# EAGLE design adapter_v2 (EAGLE 9.4.2)
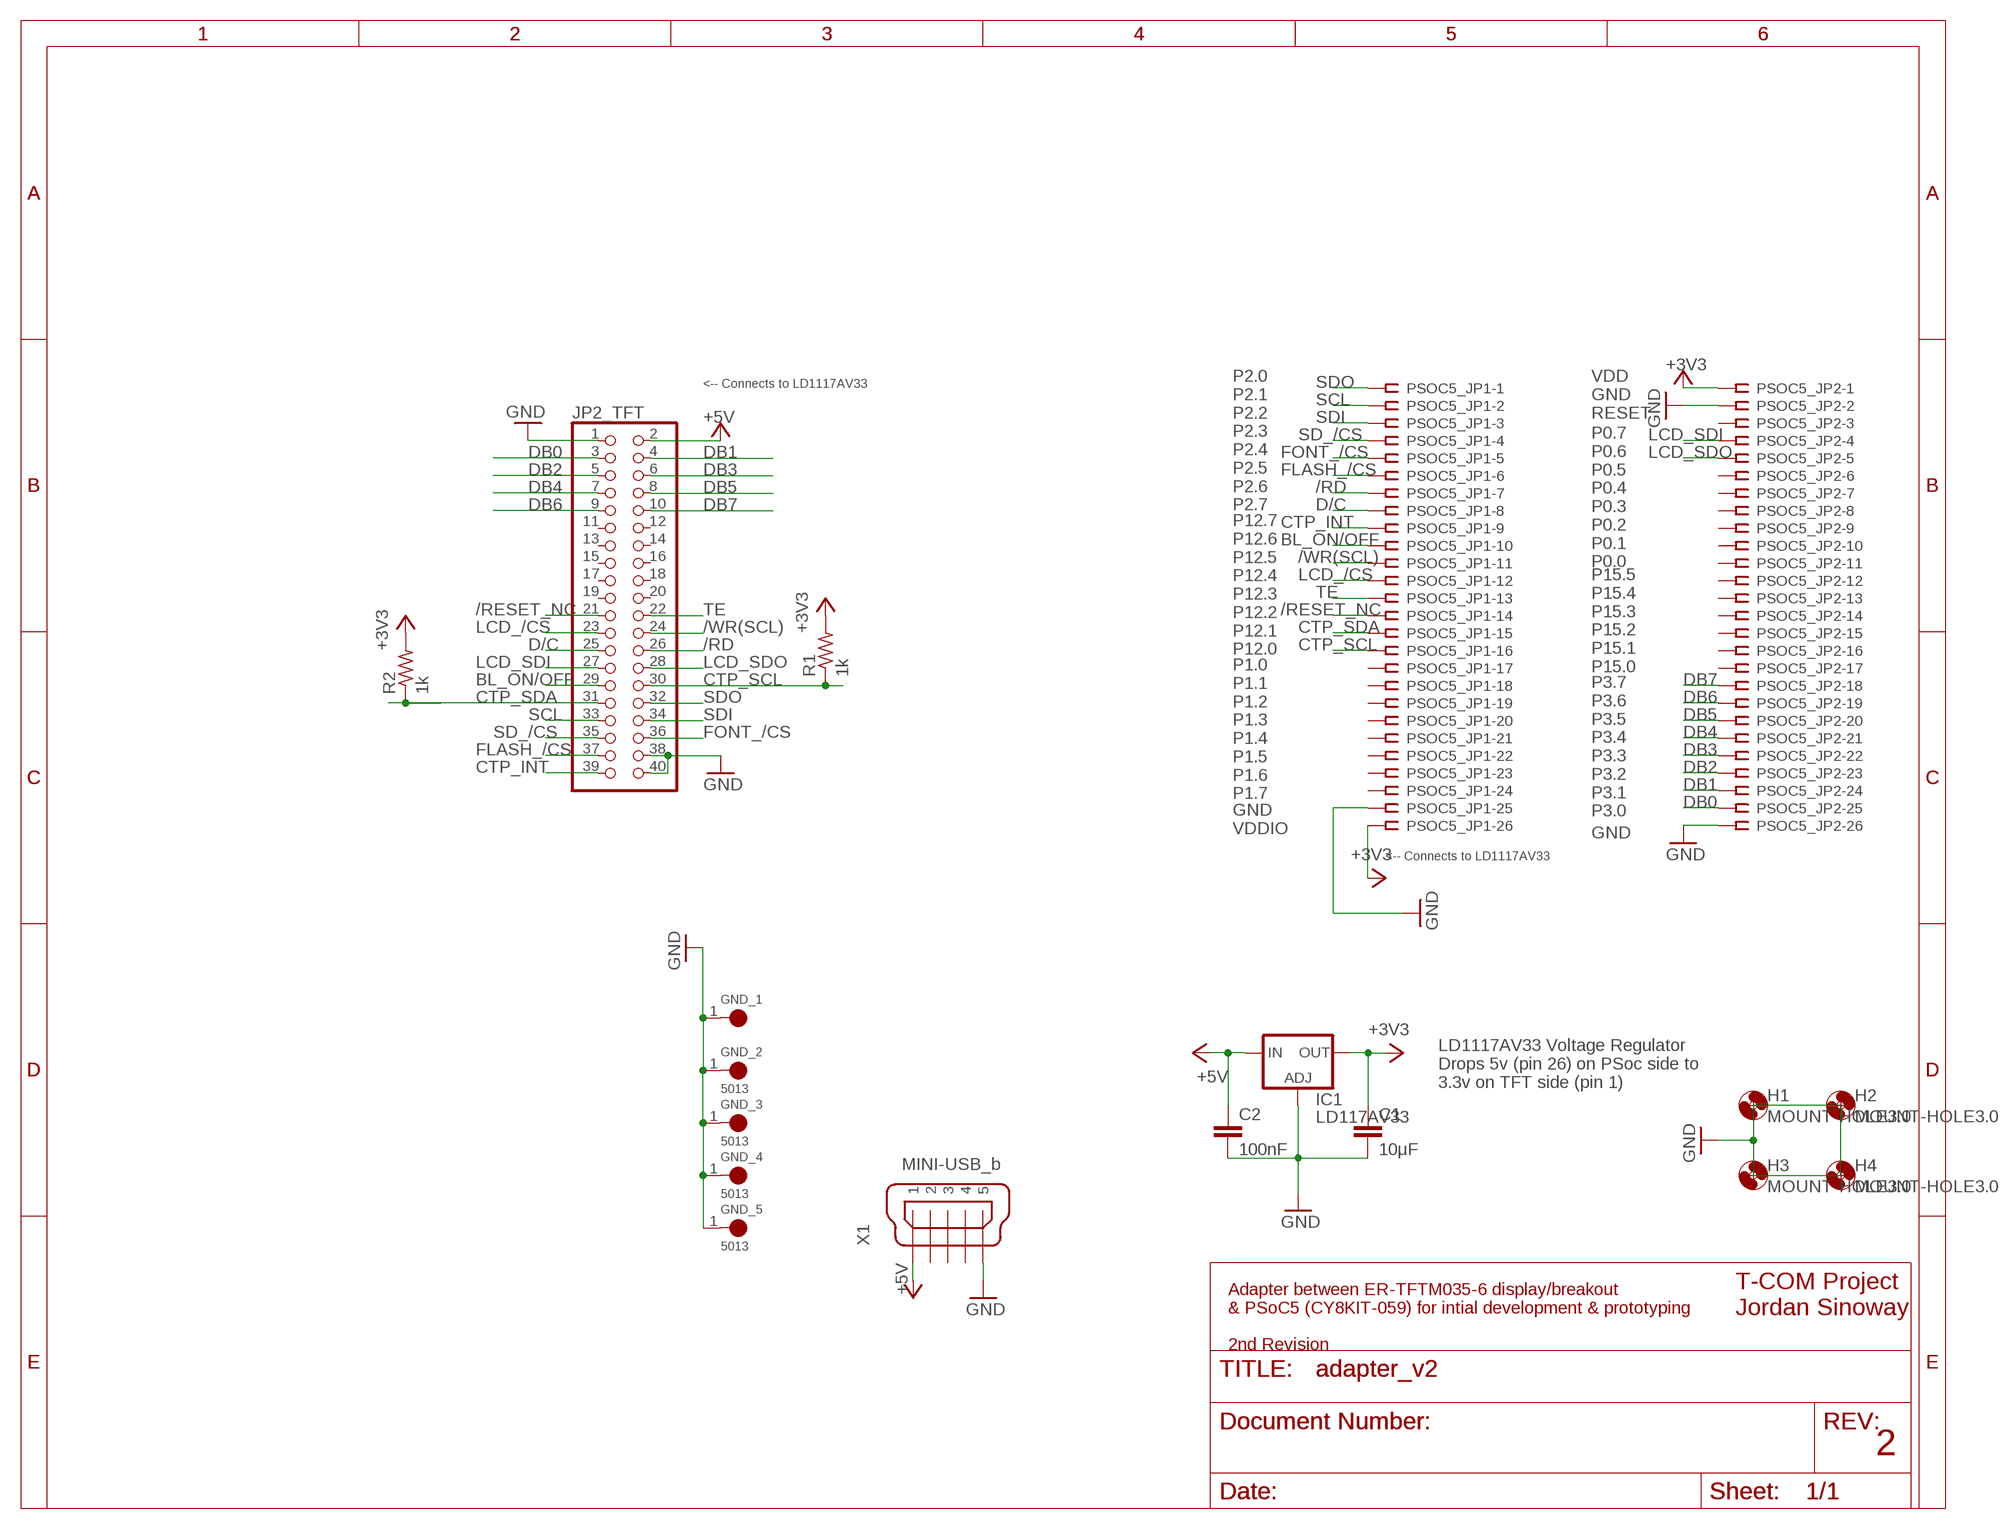
[diagram p0: schematic, sheet 1]

## Parts
C1  10μF  C2.5/2  [C2.5-2]
C2  100nF  C2.5/2  [C2.5-2]
GND_1  5013  [TESTPOINT_5013]
GND_2  5013  [TESTPOINT_5013]
GND_3  5013  [TESTPOINT_5013]
GND_4  5013  [TESTPOINT_5013]
GND_5  5013  [TESTPOINT_5013]
H1  MOUNT-HOLE3.0  [3,0]
H2  MOUNT-HOLE3.0  [3,0]
H3  MOUNT-HOLE3.0  [3,0]
H4  MOUNT-HOLE3.0  [3,0]
IC1  LD117AV33  [TO220L1]
JP2_TFT  PINHD-2X20  [2X20]
PSOC5_JP1  SSW-126-02-G-S  [SSW-126-02-G-S]
PSOC5_JP2  SSW-126-02-G-S  [SSW-126-02-G-S]
R1  1k  R-US_0204/7  [0204/7]
R2  1k  R-US_0204/7  [0204/7]
X1  MINI-USB_b  MINI-USB_SHIELD5P2-32005-601  [32005-601]

## Nets
+3V3 [GND/voltage]: C1.1 IC1.2(OUT) PSOC5_JP1.26 PSOC5_JP2.1 R1.2 R2.2
+5V [GND/voltage]: C2.1 IC1.3(IN) JP2_TFT.2 X1.1
/RD: JP2_TFT.26 PSOC5_JP1.7
/RESET_NC: JP2_TFT.21 PSOC5_JP1.14
/WR(SCL): JP2_TFT.24 PSOC5_JP1.11
BL_ON/OFF: JP2_TFT.29 PSOC5_JP1.10
CTP_INT: JP2_TFT.39 PSOC5_JP1.9
CTP_SCL: JP2_TFT.30 PSOC5_JP1.16 R1.1
CTP_SDA: JP2_TFT.31 PSOC5_JP1.15 R2.1
D/C: JP2_TFT.25 PSOC5_JP1.8
DB0: JP2_TFT.3 PSOC5_JP2.25
DB1: JP2_TFT.4 PSOC5_JP2.24
DB2: JP2_TFT.5 PSOC5_JP2.23
DB3: JP2_TFT.6 PSOC5_JP2.22
DB4: JP2_TFT.7 PSOC5_JP2.21
DB5: JP2_TFT.8 PSOC5_JP2.20
DB6: JP2_TFT.9 PSOC5_JP2.19
DB7: JP2_TFT.10 PSOC5_JP2.18
FLASH_/CS: JP2_TFT.37 PSOC5_JP1.6
FONT_/CS: JP2_TFT.36 PSOC5_JP1.5
GND [GND/voltage]: C1.2 C2.2 GND_1.1(TP) GND_2.1(TP) GND_3.1(TP) GND_4.1(TP) GND_5.1(TP) IC1.1(ADJ) JP2_TFT.1 JP2_TFT.38 JP2_TFT.40 PSOC5_JP1.25 PSOC5_JP2.2 PSOC5_JP2.26 X1.5
LCD_/CS: JP2_TFT.23 PSOC5_JP1.12
LCD_SDI: JP2_TFT.27 PSOC5_JP2.4
LCD_SDO: JP2_TFT.28 PSOC5_JP2.5
SCL: JP2_TFT.33 PSOC5_JP1.2
SD_/CS: JP2_TFT.35 PSOC5_JP1.4
SDI: JP2_TFT.34 PSOC5_JP1.3
SDO: JP2_TFT.32 PSOC5_JP1.1
TE: JP2_TFT.22 PSOC5_JP1.13
Unconnected: JP2_TFT.11 JP2_TFT.12 JP2_TFT.13 JP2_TFT.14 JP2_TFT.15 JP2_TFT.16 JP2_TFT.17 JP2_TFT.18 JP2_TFT.19 JP2_TFT.20 PSOC5_JP1.17 PSOC5_JP1.18 PSOC5_JP1.19 PSOC5_JP1.20 PSOC5_JP1.21 PSOC5_JP1.22 PSOC5_JP1.23 PSOC5_JP1.24 PSOC5_JP2.3 PSOC5_JP2.6 PSOC5_JP2.7 PSOC5_JP2.8 PSOC5_JP2.9 PSOC5_JP2.10 PSOC5_JP2.11 PSOC5_JP2.12 PSOC5_JP2.13 PSOC5_JP2.14 PSOC5_JP2.15 PSOC5_JP2.16 PSOC5_JP2.17 X1.2 X1.3 X1.4 X1.M1(S1) X1.M2(S2)

## Notes on the sheet
- <-- Connects to LD1117AV33
- VDD
  GND
  RESET
- P2.0
  P2.1
  P2.2
  P2.3
  P2.4
  P2.5
  P2.6
  P2.7
- P0.7
  P0.6
  P0.5
  P0.4
  P0.3
  P0.2
  P0.1
  P0.0
- P12.7
  P12.6
  P12.5
  P12.4
  P12.3
  P12.2
  P12.1
  P12.0
- P15.5
  P15.4
  P15.3
  P15.2
  P15.1
  P15.0
- P1.0
  P1.1
  P1.2
  P1.3
  P1.4
  P1.5
  P1.6
  P1.7
- P3.7
  P3.6
  P3.5
  P3.4
  P3.3
  P3.2
  P3.1
  P3.0
- GND
  VDDIO
- GND
- <-- Connects to LD1117AV33
- LD1117AV33 Voltage Regulator
  Drops 5v (pin 26) on PSoc side to
  3.3v on TFT side (pin 1)
- T-COM Project
  Jordan Sinoway
- Adapter between ER-TFTM035-6 display/breakout 
  & PSoC5 (CY8KIT-059) for intial development & prototyping
  
  2nd Revision
- 2

## Library data of the parts
C1 C2 = capacitor-wima:C: CAPACITOR naming: grid - package width
GND_1-GND_5 = 5013:5013: Test Point; Orange; Thru-Hole; Snap-Fit; SilverPlate; 0.063in. Dia.; 0.445In.; AVAILABILITY: Unavailable; DESCRIPTION: Test Point; Orange; Thru-Hole; Snap-Fit; SilverPlate; 0.063in. Dia.; 0.445In.; MF: Keystone Electronics; MP: 5013; PACKAGE: TO-5 Keystone; PRICE: None
H1-H4 = holes:MOUNT-HOLE: MOUNTING HOLE with drill center marker
IC1 = v-reg:LD117A?*: Low drop fixed and adjustable positive voltage regulators 1 A Source: http://www.st.com/stonline/products/literature/ds/7194/ld1117axx.pdf
JP2_TFT = pinhead:PINHD-2X20: PIN HEADER
PSOC5_JP1 PSOC5_JP2 = con-samtec:SSW-126-02-G-S: THROUGH-HOLE .025" SQ POST SOCKET Source: Samtec SSW.pdf; MF: Samtec Inc.; MPN: SSW-126-02-G-S; OC_FARNELL: unknown; OC_NEWARK: 11P9742
R1 R2 = resistor:R-US_: RESISTOR, American symbol
X1 = con-cypressindustries:MINI-USB_SHIELD5P2-: MINI USB-B R/A DIP 5pol. Source: www.cypressindustries.com; OC_FARNELL: unknown; OC_NEWARK: unknown

## Net classes
0 default: clearance 0.102 mm
1 GND/voltage: width 0.457 mm, drill 0.152 mm, clearance 0.152 mm

## Board
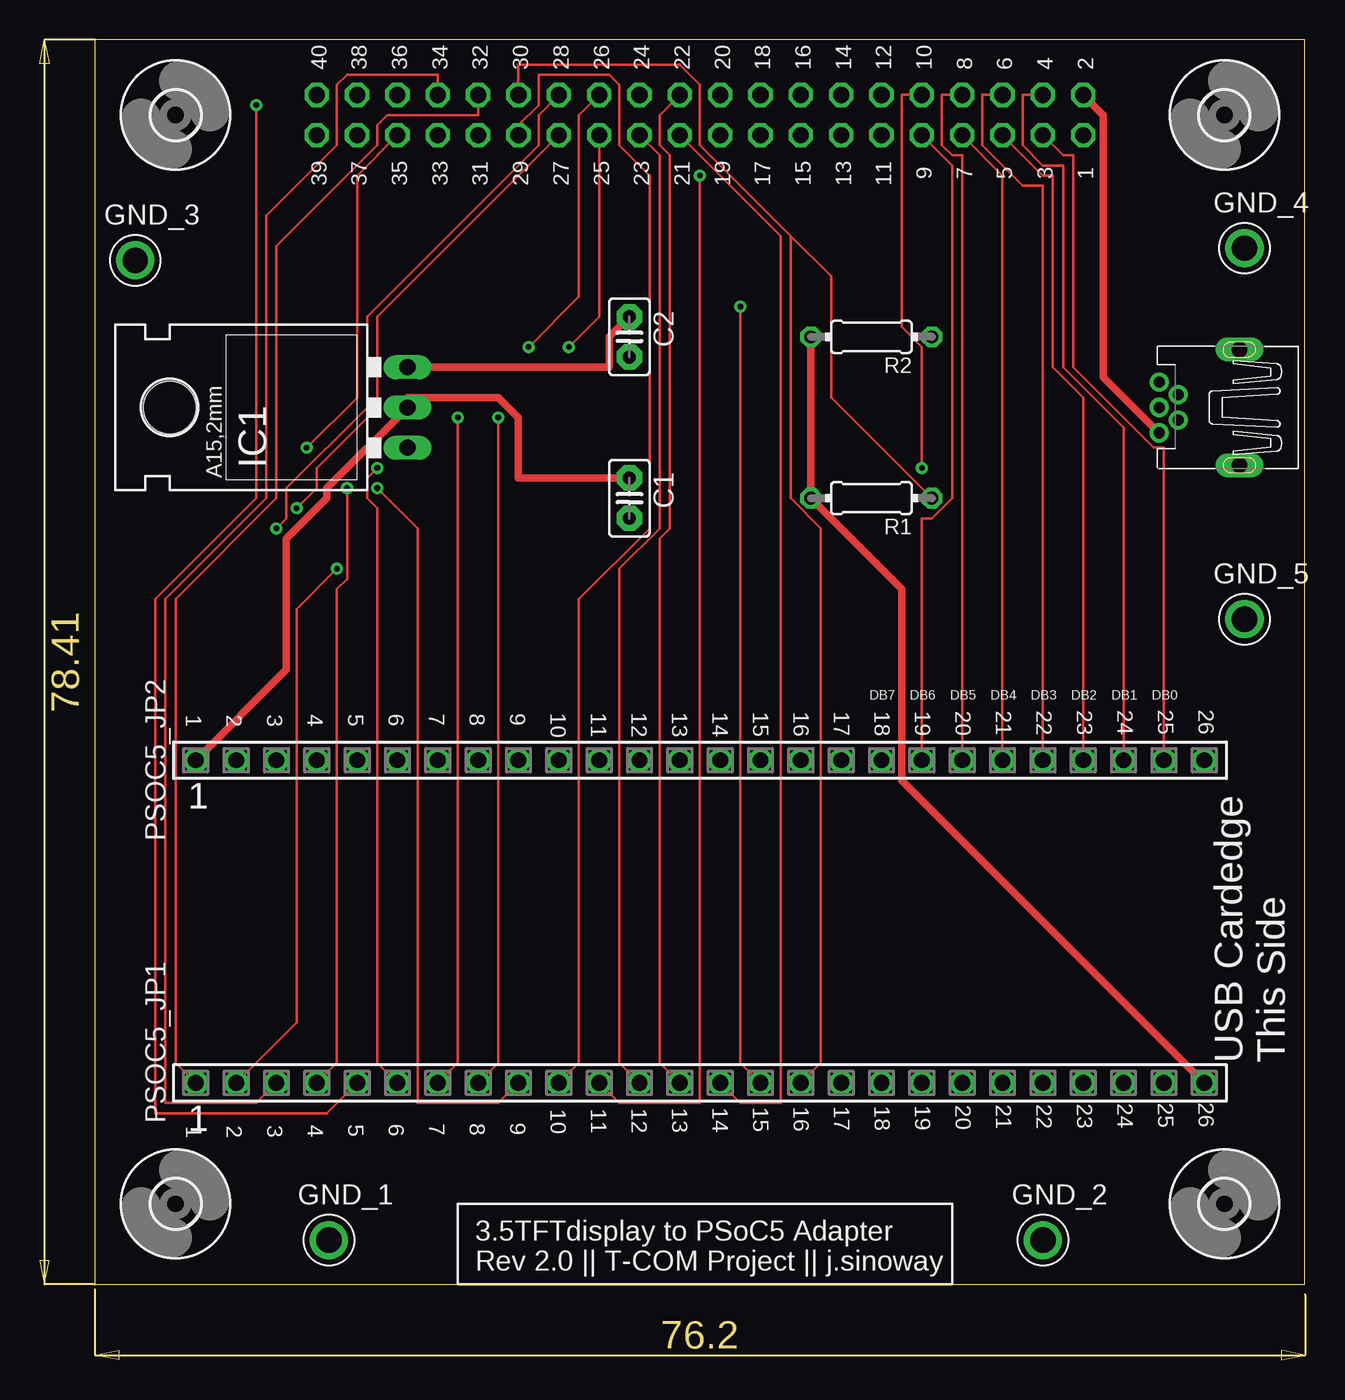
[diagram p1: board, top side]
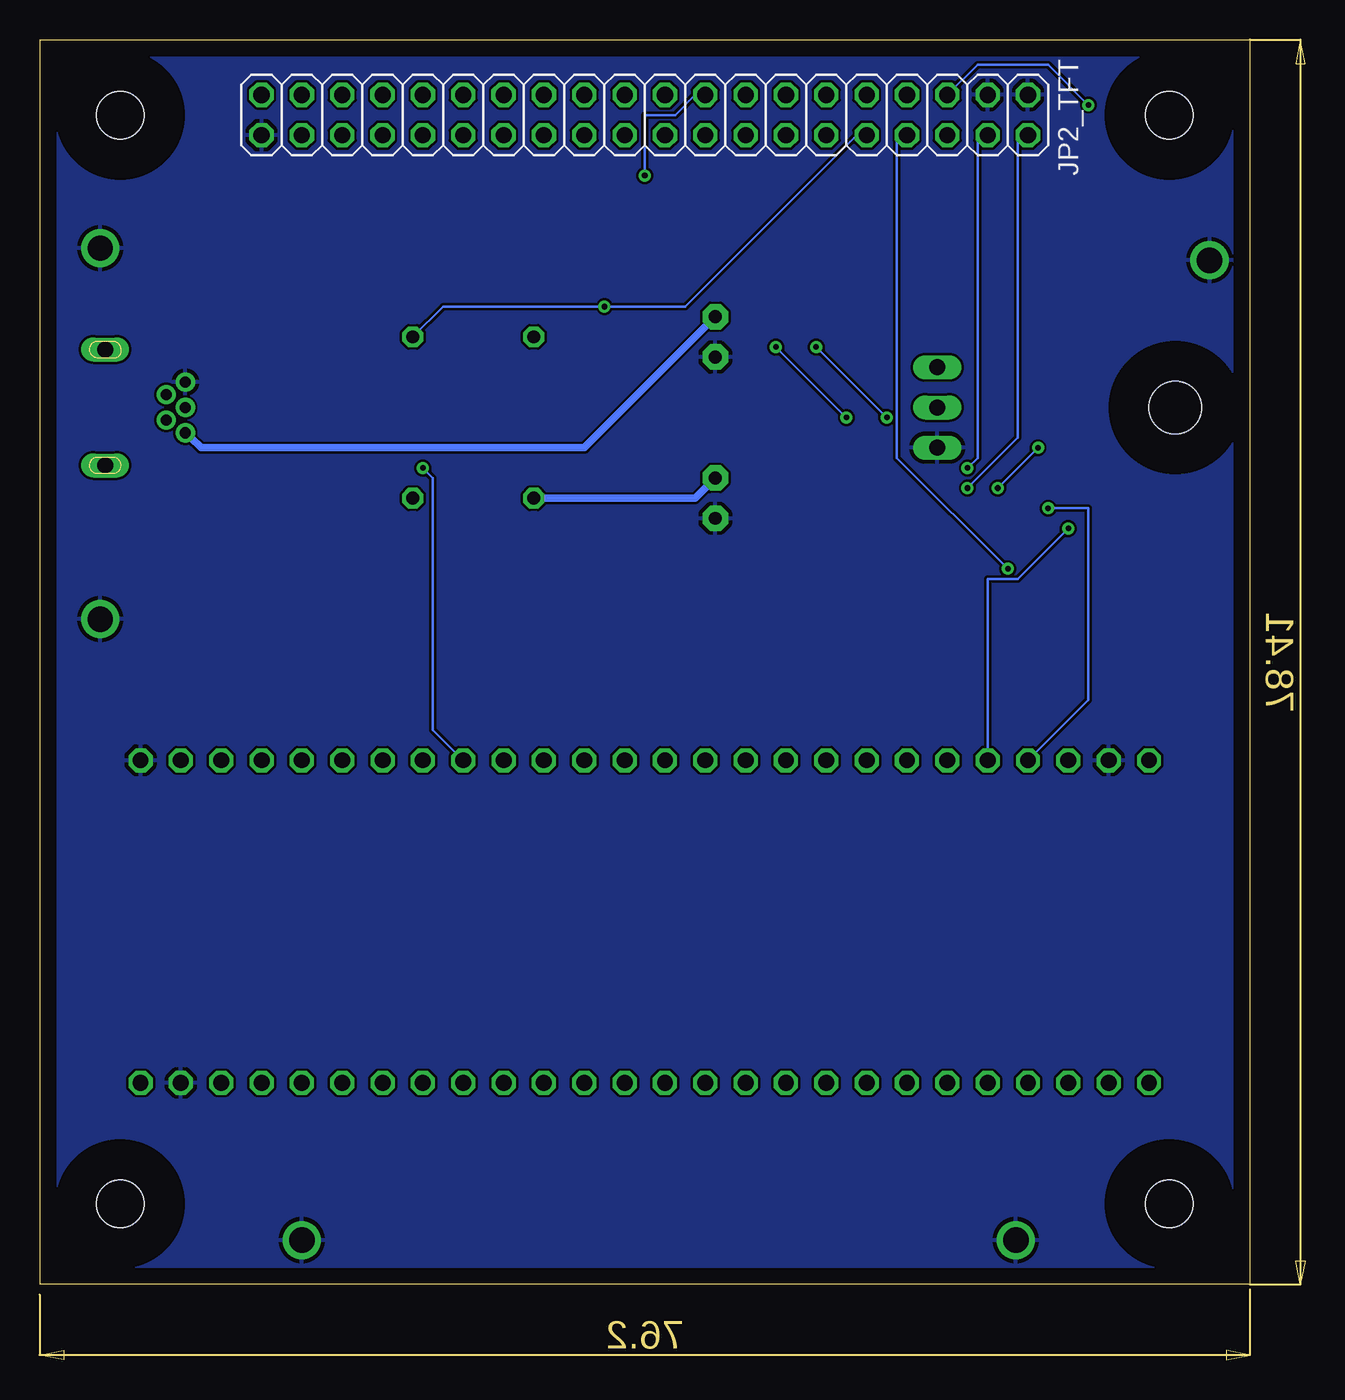
[diagram p2: board, bottom side, seen from below]

Size 76.18 x 78.41 mm. Coordinates in mm from the lower left corner, seen from the top.
Outline: 0,0 76.18,0 76.18,78.41 0,78.41 0,0
Copper layers (1*16): Top 0.035mm / dielectric 1.5mm / Bottom 0.035mm
Design rules "default": minimum track width 6mil, minimum drill 0.35mm, track to track 6mil, track to pad 6mil, pad to pad 6mil, via to via 6mil, smd to smd 6mil, copper to edge 40mil, drill to drill 6mil, minimum pad ring 10mil, minimum via ring 8mil, stop-mask expansion 4mil, vias tented up to drill 0mil, thermal gap 10mil

### Footprints (pad centres in the part's own frame; a part is rotated, then mirrored left to right if it is on the bottom)
C2.5-2 = drill 0.813 pad 1.6 octagon: 1 -1.27,0; 2 1.27,0
TESTPOINT_5013 = drill 1.6: 1 0,0
3,0 = hole 3: 0,0
TO220L1 = drill 1.016 long: 1 -2.54,-3.81; 2 0,-3.81; 3 2.54,-3.81 | hole 3.302: 0,11.176
2X20 = drill 1.016 octagon: 1 -24.13,-1.27; 2 -24.13,1.27; 3 -21.59,-1.27; 4 -21.59,1.27; 5 -19.05,-1.27; 6 -19.05,1.27; 7 -16.51,-1.27; 8 -16.51,1.27; 9 -13.97,-1.27; 10 -13.97,1.27; 11 -11.43,-1.27; 12 -11.43,1.27; 13 -8.89,-1.27; 14 -8.89,1.27; 15 -6.35,-1.27; 16 -6.35,1.27; 17 -3.81,-1.27; 18 -3.81,1.27; 19 -1.27,-1.27; 20 -1.27,1.27; 21 1.27,-1.27; 22 1.27,1.27; 23 3.81,-1.27; 24 3.81,1.27; 25 6.35,-1.27; 26 6.35,1.27; 27 8.89,-1.27; 28 8.89,1.27; 29 11.43,-1.27; 30 11.43,1.27; 31 13.97,-1.27; 32 13.97,1.27; 33 16.51,-1.27; 34 16.51,1.27; 35 19.05,-1.27; 36 19.05,1.27; 37 21.59,-1.27; 38 21.59,1.27; 39 24.13,-1.27; 40 24.13,1.27
SSW-126-02-G-S = drill 1 pad 1.5 octagon: 1 -31.75,0; 2 -29.21,0; 3 -26.67,0; 4 -24.13,0; 5 -21.59,0; 6 -19.05,0; 7 -16.51,0; 8 -13.97,0; 9 -11.43,0; 10 -8.89,0; 11 -6.35,0; 12 -3.81,0; 13 -1.27,0; 14 1.27,0; 15 3.81,0; 16 6.35,0; 17 8.89,0; 18 11.43,0; 19 13.97,0; 20 16.51,0; 21 19.05,0; 22 21.59,0; 23 24.13,0; 24 26.67,0; 25 29.21,0; 26 31.75,0
0204/7 = drill 0.813 octagon: 1 -3.81,0; 2 3.81,0
32005-601 = drill 0.7 pad 1.016: 1 2.825,1.6; 2 1.625,0.8; 3 2.825,0; 4 1.625,-0.8; 5 2.825,-1.6 | drill 1 pad 1.422 long: M1 -2.225,3.65; M2 -2.225,-3.65

### Placement (x,y rotation side)
C1  33.66,49.53 270 top
C2  33.66,59.69 270 top
GND_1  14.73,2.79 0 top
GND_2  59.69,2.79 0 top
GND_3  2.54,64.52 0 top
GND_4  72.39,65.28 0 top
GND_5  72.39,41.91 0 top
H1  5.08,73.66 0 top
H2  71.12,73.66 0 top
H3  5.08,5.08 0 top
H4  71.12,5.08 0 top
IC1  15.88,55.25 90 top
JP2_TFT  38.1,73.66 0 bottom
PSOC5_JP1  38.1,12.7 0 top
PSOC5_JP2  38.1,33.02 0 top
R1  48.9,49.53 180 top
R2  48.9,59.69 180 top
X1  69.85,55.25 180 top

### Tracks (layer width: path | path; a pad name or v marks a point on that pad's centre or on a via)
+3V3
  Top 0.457: PSOC5_JP2.1 12.06,38.73 12.06,46.99 14.61,49.53 14.61,50.17 IC1.2 19.68,55.88 25.4,55.88 26.67,54.61 26.67,50.8 C1.1 | R2.2 R1.2 50.8,43.81 50.8,31.75 PSOC5_JP1.26
  Bottom 0.457: C1.1 34.92,49.53 R1.2
+5V
  Top 0.457: IC1.3 32.38,57.78 32.38,59.69 C2.1 | JP2_TFT.2 63.5,73.66 63.5,57.15 66.67,53.97 X1.1
  Bottom 0.457: C2.1 41.91,52.7 66.04,52.7 66.67,53.34 X1.1
/RD  (via drill 0.35)
  Top 0.152: PSOC5_JP1.7 22.86,13.97 v22.86,54.61 | v27.3,59.06 30.48,62.23 30.48,73.66 JP2_TFT.26
  Bottom 0.152: v27.3,59.06 v22.86,54.61
/RESET_NC
  Top 0.152: PSOC5_JP1.14 40.64,11.43 43.18,11.43 43.18,66.04 JP2_TFT.21
/WR(SCL)  (via drill 0.35)
  Top 0.152: PSOC5_JP1.11 33.02,11.43 38.1,11.43 v38.1,69.85
  Bottom 0.152: v38.1,69.85 38.1,73.66 36.2,73.66 34.92,74.93 JP2_TFT.24
BL_ON/OFF
  Top 0.152: PSOC5_JP1.10 30.48,13.97 30.48,43.18 34.92,47.62 34.92,69.85 33.02,71.75 33.02,75.56 32.38,76.2 27.94,76.2 27.94,74.3 26.67,73.03 JP2_TFT.29
CTP_INT  (via drill 0.35)
  Top 0.152: PSOC5_JP1.9 25.4,11.43 20.32,11.43 20.32,47.62 v17.78,50.17
  Bottom 0.152: v17.78,50.17 14.61,53.34 14.61,72.39 JP2_TFT.39
CTP_SCL
  Top 0.152: R1.1 46.35,55.88 46.35,63.5 43.81,66.04 | 43.81,66.04 38.1,71.75 38.1,75.56 36.83,76.83 26.67,76.83 JP2_TFT.30 | PSOC5_JP1.16 45.72,13.97 45.72,47.62 43.81,49.53 43.81,66.04
CTP_SDA  (via drill 0.35)
  Top 0.152: PSOC5_JP1.15 40.64,13.97 v40.64,61.59
  Bottom 0.152: R2.1 50.8,61.59 v40.64,61.59 35.56,61.59 24.77,72.39 JP2_TFT.31
D/C  (via drill 0.35)
  Top 0.152: PSOC5_JP1.8 25.4,13.97 v25.4,54.61 | v29.84,59.06 31.75,60.96 JP2_TFT.25
  Bottom 0.152: v29.84,59.06 v25.4,54.61
DB0
  Top 0.152: PSOC5_JP2.25 67.31,52.7 66.67,52.7 61.59,57.78 61.59,71.12 60.96,71.12 JP2_TFT.3
DB1
  Top 0.152: PSOC5_JP2.24 64.77,53.97 60.96,57.78 60.96,70.48 59.69,70.48 58.42,71.75 58.42,74.93 JP2_TFT.4
DB2
  Top 0.152: PSOC5_JP2.23 62.23,55.88 60.33,57.78 60.33,69.85 59.69,69.85 JP2_TFT.5
DB3
  Top 0.152: PSOC5_JP2.22 59.69,69.22 58.42,69.22 55.88,71.75 55.88,74.93 JP2_TFT.6
DB4
  Top 0.152: PSOC5_JP2.21 57.15,69.85 JP2_TFT.7
DB5
  Top 0.152: PSOC5_JP2.20 54.61,71.12 53.98,71.12 53.34,71.75 53.34,74.93 JP2_TFT.8
DB6
  Top 0.152: PSOC5_JP2.19 52.07,48.26 52.7,48.26 53.98,49.53 53.98,70.48 JP2_TFT.9
DB7  (via drill 0.35)
  Top 0.152: v52.07,51.44 52.07,59.06 50.8,60.33 50.8,74.93 JP2_TFT.10
  Bottom 0.152: PSOC5_JP2.18 51.44,34.92 51.44,50.8 v52.07,51.44
FLASH_/CS  (via drill 0.35)
  Top 0.152: PSOC5_JP1.6 17.78,13.97 17.78,48.89 17.14,49.53 17.14,50.8 v17.78,51.44
  Bottom 0.152: v17.78,51.44 17.14,52.07 17.14,72.39 JP2_TFT.37
FONT_/CS  (via drill 0.35)
  Top 0.152: PSOC5_JP1.5 14.61,10.79 3.81,10.79 3.81,43.18 10.16,49.53 v10.16,74.3
  Bottom 0.152: v10.16,74.3 12.7,76.83 17.14,76.83 JP2_TFT.36
GND
  pour Bottom: 0,77.47 76.2,77.47 76.2,68.58 76.2,0 72.39,0 0,0
LCD_/CS
  Top 0.152: PSOC5_JP1.12 33.02,13.97 33.02,45.08 35.56,47.62 35.56,71.12 JP2_TFT.23
LCD_SDI  (via drill 0.35)
  Top 0.152: v12.7,48.89 13.97,50.17 13.97,51.44 17.78,55.25 17.78,60.96 JP2_TFT.27
  Bottom 0.152: PSOC5_JP2.4 10.16,36.83 10.16,48.89 v12.7,48.89
LCD_SDO  (via drill 0.35)
  Top 0.152: v11.43,47.62 12.06,48.26 12.06,50.17 17.14,55.25 17.14,60.96 27.94,71.75 27.94,73.66 JP2_TFT.28
  Bottom 0.152: PSOC5_JP2.5 16.51,44.45 14.61,44.45 v11.43,47.62
SCL  (via drill 0.35)
  Top 0.152: PSOC5_JP1.2 12.7,16.51 12.7,42.55 v15.24,45.08
  Bottom 0.152: v15.24,45.08 22.23,52.07 22.23,72.39 JP2_TFT.33
SD_/CS  (via drill 0.35)
  Top 0.152: PSOC5_JP1.4 15.24,13.97 15.24,43.81 15.88,44.45 v15.88,50.17 | v13.34,52.7 16.51,55.88 16.51,69.85 JP2_TFT.35
  Bottom 0.152: v13.34,52.7 v15.88,50.17
SDI
  Top 0.152: PSOC5_JP1.3 10.16,11.43 4.45,11.43 4.45,43.18 10.79,49.53 10.79,67.31 15.24,71.75 15.24,75.56 15.88,76.2 21.59,76.2 JP2_TFT.34
SDO
  Top 0.152: PSOC5_JP1.1 5.08,13.97 5.08,43.18 11.43,49.53 11.43,65.41 17.78,71.75 17.78,73.03 18.41,73.66 24.13,73.66 JP2_TFT.32
TE
  Top 0.152: PSOC5_JP1.13 35.56,13.97 35.56,46.99 36.2,47.62 36.2,71.12 35.56,71.75 35.56,73.66 JP2_TFT.22

### Text on the board
tNames: 40 / 38 / 36 / 34 / 32 / 30 / 28 / 26 / 24 / 22 / 20 / 18 / 16 / 14 / 12 / 10 / 8 / 6 / 4 / 2 | 39 / 37 / 35 / 33 / 31 / 29 / 27 / 25 / 23 / 21 / 19 / 17 / 15 / 13 / 11 / 9 / 7 / 5 / 3 / 1 | DB7 | DB6 | DB5 | DB4 | DB3 | DB2 | DB1 | DB0 | 26 / 25 / 24 / 23 / 22 / 21 / 20 / 19 / 18 / 17 / 16 / 15 / 14 / 13 / 12 / 11 / 10 / 9 / 8 / 7 / 6 / 5 / 4 / 3 / 2 / 1 | USB Cardedge / This Side | 26 / 25 / 24 / 23 / 22 / 21 / 20 / 19 / 18 / 17 / 16 / 15 / 14 / 13 / 12 / 11 / 10 / 9 / 8 / 7 / 6 / 5 / 4 / 3 / 2 / 1 | 3.5TFTdisplay to PSoC5 Adapter / Rev 2.0 || T-COM Project || j.sinoway